# EAGLE design picopower (EAGLE 9.6.1)
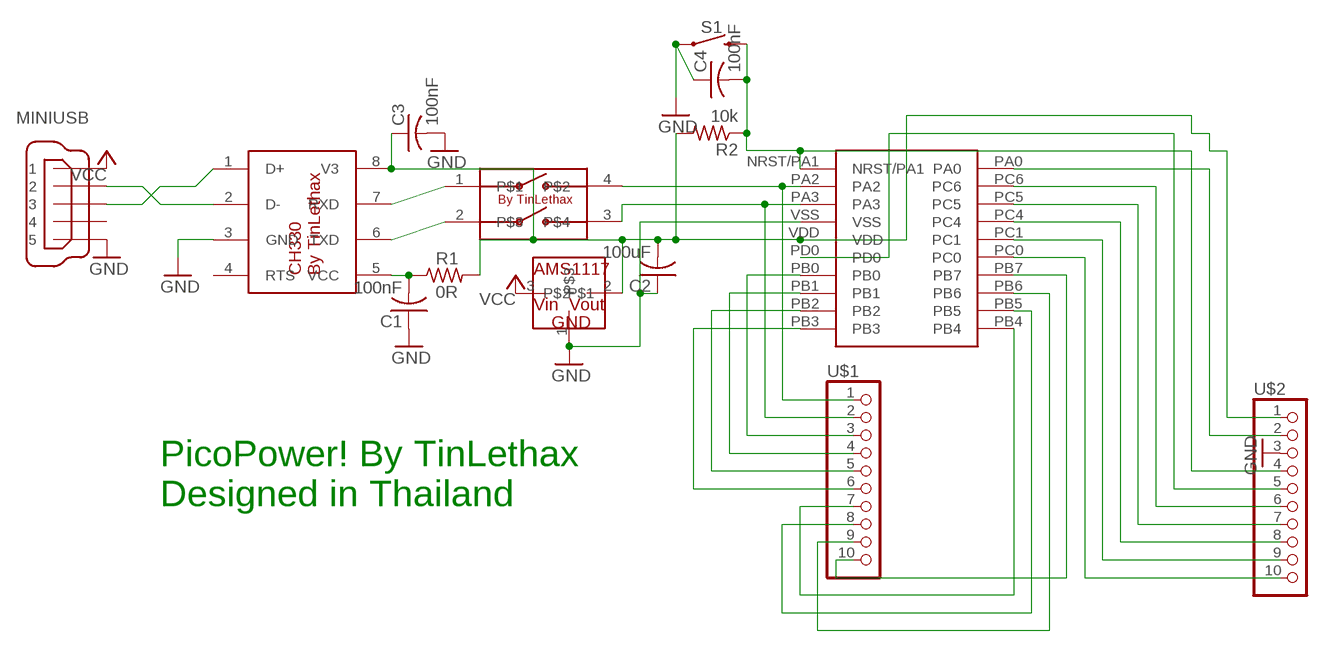
[diagram p0: schematic, sheet 1]

## Parts
2DIP  2DIPSWITCH  [SOIC127P835X230-4N]
C1  100nF  C-USC0603K  [C0603K]
C2  100uF  C-USC0603K  [C0603K]
C3  100nF  C-USC0603K  [C0603K]
C4  100nF  C-USC0603K  [C0603K]
CH330  CH330  [SOIC127P600X150-8N]
MINIUSB  MINI-USB-UX60A-MB-5ST  [UX60A-MB-5ST]
R1  0R  R-US_R0603  [R0603]
R2  10k  R-US_R0603  [R0603]
S1  MOMENTARY-SWITCH-SPST-SMD-6.0X3.5MM  [TACTILE_SWITCH_SMD_6.0X3.5MM]
STM8L  STM8L151F3  [UFQFPN-20]
U$1  PINHD-1X10  [1X10-BIG]
U$2  PINHD-1X10  [1X10-BIG]
U$3  AMS1117  [SOT223]

## Nets
GND: C1.1 C2.1 C3.2 C4.1 CH330.3(GND) MINIUSB.5 S1.1 STM8L.VSS U$2.3 U$3.1
N$1: 2DIP.1 CH330.7(RXD)
N$2: 2DIP.2 CH330.6(TXD)
N$3: 2DIP.4 STM8L.PA2 U$1.1
N$4: 2DIP.3 STM8L.PA3 U$1.2
N$5: C1.2 CH330.5(VCC) R1.1
N$6: C2.2 C3.1 CH330.8(V3) R1.2 R2.2 STM8L.VDD U$2.1 U$3.2
N$8: STM8L.PB0 U$1.3
N$9: STM8L.PB1 U$1.4
N$10: STM8L.PB2 U$1.5
N$11: STM8L.PB3 U$1.6
N$12: STM8L.PB4 U$1.7
N$13: STM8L.PB5 U$1.8
N$14: STM8L.PB6 U$1.9
N$15: STM8L.PB7 U$1.10
N$16: STM8L.PC0 U$2.10
N$17: STM8L.PC1 U$2.9
N$18: STM8L.PC4 U$2.8
N$19: STM8L.PC5 U$2.7
N$20: STM8L.PC6 U$2.6
N$21: CH330.2(D-) MINIUSB.2
N$22: C4.2 R2.1 S1.2 STM8L.NRST/PA1 U$2.4
N$23: STM8L.PA0 U$2.2
N$24: STM8L.PD0 U$2.5
N$25: CH330.1(D+) MINIUSB.3
VCC: MINIUSB.1 U$3.3
Unconnected: CH330.4(RTS) MINIUSB.4

## Notes on the sheet
- PicoPower! By TinLethax
  Designed in Thailand

## Library data of the parts
2DIP = KE_DIP_SWITCH_2:2DIPSWITCH: Shenzhen Ke Rotary Dip Switch (x2); PACKAGE: SOP4
C1-C4 = adafruit:C-US: CAPACITOR, American symbol
CH330 = CH330:CH330: CH330 Super small Serial to USB chip; DESCRIPTION: CH330 Super small Serial to USB chip; PACKAGE: SOP8; PARTNO: CH330
MINIUSB = con-hirose:MINI-USB-: MINI USB Connector Source: http://www.hirose.co.jp/cataloge_hp/e24000019.pdf; OC_FARNELL: unknown; OC_NEWARK: unknown
R1 R2 = adafruit:R-US_: RESISTOR, American symbol
S1 = SparkFun-Switches:MOMENTARY-SWITCH-SPST: Momentary Switch (Pushbutton) - SPST Normally-open (NO) SPST momentary switches (buttons, pushbuttons). Variants PTH-12MM - 12mm square, through-hole Momentary Pushbutton Switch - 12mm Square <https://www.sparkfun.com/products/9190> (COM-09190) PTH-6.0MM, PTH-6.0MM-KIT - 6.0mm square, through-hole Mini Pushbutton Switch <https://www.sparkfun.com/products/97> (COM-00097) KIT package intended for soldering kit's - only one side of pads' copper is exposed. PTH-RIGHT-ANGLE-KIT - Right-angle, through-hole Right Angle Tactile Button <https://www.sparkfun.com/products/10791> - Used on SparkFun BigTime Watch Kit <https://www.sparkfun.com/products/11734> SMD-12MM - 12mm square, surface-mount Tactile Button - SMD (12mm) <https://www.sparkfun.com/products/12993> (COM-12993) Used on SparkFun PicoBoard <https://www.sparkfun.com/products/11888> SMD-4.5MM - 4.5mm Square Trackball Switch Used on SparkFun Blackberry Trackballer Breakout <https://www.sparkfun.com/products/13169> SMD-4.6MMX2.8MM - 4.60mm x 2.80mm, surface mount Used on SparkFun SAMD21 Mini Breakout <https://www.sparkfun.com/products/13664> SMD-5.2MM, SMD-5.2-REDUNDANT - 5.2mm square, surface-mount Mini Pushbutton Switch - SMD <https://www.sparkfun.com/products/8720> (COM-08720) Used on Arduino Pro Mini <https://www.sparkfun.com/products/11114> REDUNDANT package connects both switch circuits together SMD-6.0X3.5MM - 6.0 x 3.5mm, surface mount Momentary Reset Switch SMD <https://www.sparkfun.com/products/8229> (COM-08229) SMD-6.2MM-TALL - 6.2mm square, surface mount Tactile Button - SMD (6mm) <https://www.sparkfun.com/products/12992> Used on SparkFun Digital Sandbox <https://www.sparkfun.com/products/12651> SMD-RIGHT-ANGLE - Right-angle, surface mount Used on SparkFun Block for Intel® Edison - Arduino <https://www.sparkfun.com/products/13036>; PROD_ID: SWCH-00815; SF_SKU: COM-08229
STM8L = STM8L151F3:STM8L151F3: STM8L151F3 8bit mcuwith the 3x3 mm size !
U$1 U$2 = adafruit:PINHD-1X10: Pin header 1x10 0.1" spacing With round pins
U$3 = AMS1117:AMS1117: The The AMS1117 series of adjustable and fixed voltage regulators are designed to provide up to1A output current and to operate down to 1V input-to-output differential. The dropout voltage of the device is guaranteed maximum 1.3V, decreasing at lower load currents.; PARTNO: AMS1117

## Board
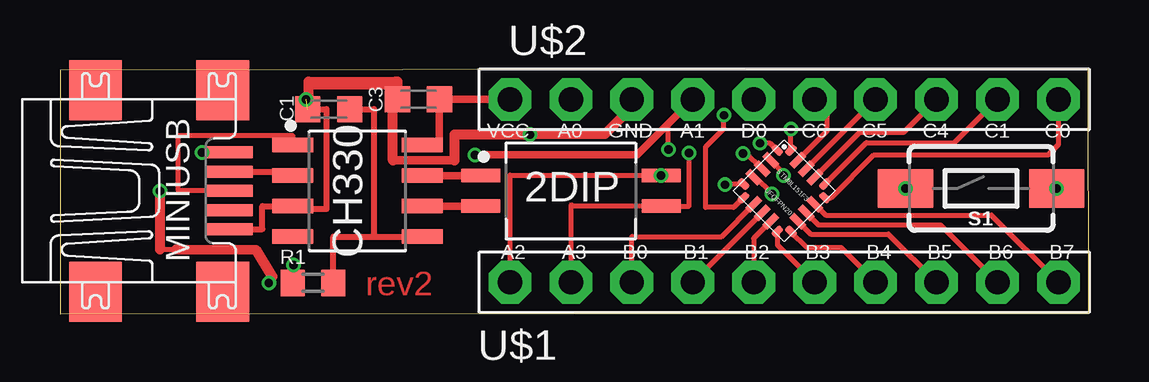
[diagram p1: board, top side]
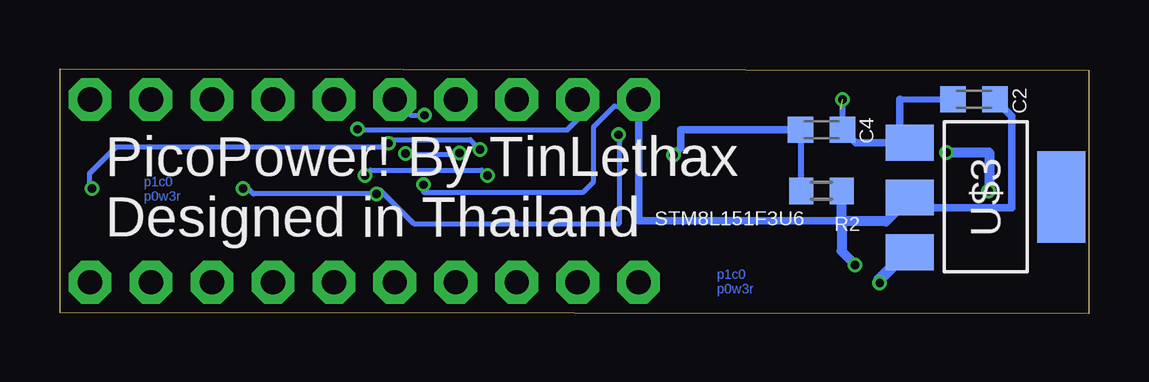
[diagram p2: board, bottom side, seen from below]

Size 42.86 x 10.21 mm. Coordinates in mm from the lower left corner, seen from the top.
Outline: 0,0 42.86,0.05 42.85,10.21 0,10.16 0,0
Copper layers (1*16): Top 0.035559375mm / dielectric 1.6mm / Bottom 0.035559375mm
Design rules "oshpark-2layer": minimum track width 6mil, minimum drill 10mil, track to track 6mil, track to pad 6mil, pad to pad 6mil, via to via 6mil, smd to smd 6mil, copper to edge 15mil, drill to drill 6mil, minimum pad ring 5mil, minimum via ring 5mil, stop-mask expansion 2.5mil, vias tented up to drill 0mil, thermal gap 10mil

### Footprints (pad centres in the part's own frame; a part is rotated, then mirrored left to right if it is on the bottom)
SOIC127P835X230-4N = smd 1.625 x 0.572: 1 -3.763,0.635; 2 -3.763,-0.635; 3 3.763,-0.635; 4 3.763,0.635
C0603K = smd 1.05 x 1.08: 1 -0.875,0; 2 0.875,0
SOIC127P600X150-8N = smd 1.708 x 0.602: 1 -2.7,1.905; 2 -2.7,0.635; 3 -2.7,-0.635; 4 -2.7,-1.905; 5 2.7,-1.905; 6 2.7,-0.635; 7 2.7,0.635; 8 2.7,1.905
UX60A-MB-5ST = smd 2 x 0.5: 1 2.25,1.6; 2 2.25,0.8; 3 2.25,0; 4 2.25,-0.8; 5 2.25,-1.6 | smd 2.2 x 2.5: M1 -3.3,-4.2; M2 -3.3,4.2; M3 2,4.2; M4 2,-4.2
R0603 = smd 1 x 1.1: 1 -0.85,0; 2 0.85,0
TACTILE_SWITCH_SMD_6.0X3.5MM = smd 2.3 x 1.6: 1 -3.15,0; 2 3.15,0
UFQFPN-20 = smd 0.5 x 0.3: NRST/PA1 -1.4,1; PB4 1.4,-1; PC0 1.4,1; VDD -1.4,-1 | smd 0.3 x 0.5: PA0 -1,1.4; PB3 1,-1.4; PC1 1,1.4; PD0 -1,-1.4 | smd 0.7 x 0.3: PA2 -1.3,0.5; PA3 -1.3,0; PB5 1.3,-0.5; PB6 1.3,0; PB7 1.3,0.5; VSS -1.3,-0.5 | smd 0.3 x 0.7: PB0 -0.5,-1.3; PB1 0,-1.3; PB2 0.5,-1.3; PC4 0.5,1.3; PC5 0,1.3; PC6 -0.5,1.3
1X10-BIG = drill 1.016 pad 1.778 octagon: 1 -11.43,0; 2 -8.89,0; 3 -6.35,0; 4 -3.81,0; 5 -1.27,0; 6 1.27,0; 7 3.81,0; 8 6.35,0; 9 8.89,0; 10 11.43,0
SOT223 = smd 1.499 x 2.007: 1 -2.261,-3.15; 2 0.025,-3.15; 3 2.311,-3.15 | smd 3.81 x 2.007: 4 0,3.15

### Placement (x,y rotation side)
2DIP  21.29,5.13 0 top
C1  11.2,8.53 0 top
C2  4.78,8.94 0 bottom
C3  14.94,8.94 180 top
C4  11.13,7.67 180 bottom
CH330  12.4,5.13 0 top
MINIUSB  4.78,5.13 0 top
R1  10.54,1.3 180 top
R2  11.13,5.13 0 bottom
S1  38.38,5.23 0 top
STM8L  30.18,5.13 315 top
U$1  30.18,1.32 0 top
U$2  30.18,8.94 0 top
U$3  4.29,4.88 270 bottom

### Tracks (layer width: path | path; a pad name or v marks a point on that pad's centre or on a via)
GND  (via drill 0.35)  (1 unrouted)
  Top 0.152: C3.2 13.79,9.21 13.79,9.5
  Top 0.203: C1.1 10.35,8.56 | v29.67,5 28.97,5.7 STM8L.VSS
  Top 0.254: MINIUSB.5 8.43,3.53 8.43,4.5 CH330.3 9.7,4.37 11.1,4.37 11.1,8.53 C1.1
  Top 0.305: 13.97,9.68 13.79,9.5 10.33,9.5 C1.1
  Top 0.356: 16.43,6.4 13.87,6.4
  Top 0.406: 10.35,8.56 10.35,9.68 13.97,9.68 14.06,9.68 C3.2 13.87,8.75 13.87,6.4 | U$2.3 23.83,8.61 22.71,7.49 19.61,7.49 v19.58,7.47 16.43,7.47 16.43,6.4
  Bottom 0.203: 23.83,3.84 23.9,3.76 | 23.9,3.76 28.12,3.76 29.52,5.16 v29.67,5 34.8,5 35.03,5.23 S1.1 | 23.9,3.76 19.56,3.76 19.56,7.44 v19.58,7.47
  Bottom 0.254: 7.87,8.94 C2.1 | C4.1 10.24,8.99 10.25,8.99 v10.25,8.94
  Bottom 0.305: 7.87,8.94 7.87,7.57 U$3.1 9.7,7.14 C4.1
  other vias: 35.23,5.23
N$1
  Top 0.305: CH330.7 2DIP.1
N$2
  Top 0.305: CH330.6 2DIP.2
N$3  (via drill 0.35)
  Top 0.203: v25.05,5.77 18.77,5.77 18.75,5.79 U$1.1 | STM8L.PA2 30.15,5.87 30.2,5.87 30.2,5.82 v30.15,5.77
  Bottom 0.203: v30.15,5.77 29.92,5.99 25.28,5.99 v25.05,5.77
N$4  (via drill 0.35)
  Top 0.203: U$1.2 21.29,4.52 21.31,4.55 21.36,4.5 2DIP.3 26.21,4.5 v26.21,6.71 | v28.46,6.69 28.51,6.74 28.56,6.74 STM8L.PA3
  Bottom 0.203: v28.46,6.69 28.46,6.65 26.26,6.65 v26.21,6.71
N$5
  Top 0.254: R1.1 11.39,3.23 CH330.5 13.08,3.23 13.08,8.53 C1.2
N$6  (via drill 0.35)
  Top 0.203: CH330.8 15.81,7.04 | STM8L.VDD 27.74,5.41 v27.71,5.38
  Top 0.305: 15.81,7.04 C3.1 U$2.1
  Top 0.406: v9.73,2.03 9.73,1.33 R1.2
  Bottom 0.203: v27.71,5.38 27.71,5.08 21.06,5.08 20.63,5.51 20.63,7.8 19.76,8.66 18.85,8.66 18.75,8.76
  Bottom 0.305: R2.2 10.29,5.13 10.29,3.89 18.75,3.89 18.75,8.76 U$2.1 | C2.2 3.19,8.23 3.19,4.42 7.01,4.42 U$3.2
  Bottom 0.406: U$3.2 8.43,3.86 10.28,3.86 R2.2 | 10.29,3.89 10.29,2.62 9.73,2.06 v9.73,2.03
N$8
  Top 0.203: U$1.3 23.83,3.23 27.56,3.23 STM8L.PB0
N$9
  Top 0.203: U$1.4 STM8L.PB1
N$10
  Top 0.203: STM8L.PB2 28.91,3.15 U$1.5
N$11
  Top 0.203: STM8L.PB3 29.89,2.87 U$1.6
N$12
  Top 0.203: STM8L.PB4 31.12,2.77 32.54,2.77 U$1.7
N$13
  Top 0.203: STM8L.PB5 31.27,3.33 34.52,3.33 U$1.8
N$14
  Top 0.203: STM8L.PB6 31.6,3.71 36.68,3.71 U$1.9
N$15
  Top 0.203: STM8L.PB7 31.9,4.11 38.81,4.11 U$1.10
N$16
  Top 0.203: STM8L.PC0 32.13,4.85 33.91,6.63 41.17,6.63 41.61,7.06 U$2.10
N$17
  Top 0.203: STM8L.PC1 33.6,7.14 37.26,7.14 U$2.9
N$18
  Top 0.203: STM8L.PC4 33.32,7.57 35.15,7.57 U$2.8
N$19
  Top 0.203: STM8L.PC5 U$2.7
N$20
  Top 0.203: STM8L.PC6 31.98,7.64 31.98,8.41 U$2.6
N$21
  Top 0.254: MINIUSB.2 9.7,5.93 CH330.2
N$22  (via drill 0.35)
  Top 0.203: U$2.4 25.32,7.9 25.32,6.88 v25.35,6.86 | 29.63,7.09 STM8L.NRST/PA1 29.9,6.82 29.9,6.8 29.59,7.11 v29.16,7.11
  Top 0.305: v17.3,6.63 24.05,6.63 U$2.4
  Bottom 0.203: S1.2 41.61,5.16 41.63,5.16 41.63,5.84 40.51,6.96 29.03,6.96 29.17,7.1 v29.16,7.11 29.01,7.26 25.76,7.26 v25.35,6.86
  Bottom 0.254: C4.2 12,5.13 R2.1
  Bottom 0.305: C4.2 16.99,7.67 16.99,6.93 v17.3,6.63
  other vias: 41.53,5.23
N$23  (via drill 0.35)
  Top 0.203: STM8L.PA0 v30.46,7.69 v30.45,7.7
  Bottom 0.203: v30.45,7.7 30.45,7.67 21.72,7.67 21.29,8.1 U$2.2
N$24  (via drill 0.35)
  Top 0.203: STM8L.PD0 28.07,4.44 26.9,4.44 26.9,6.96 27.66,7.72 v27.66,8.28
  Bottom 0.203: U$2.5 28.25,8.28 v27.66,8.28
N$25
  Top 0.203: MINIUSB.3 4.93,5.13 4.93,7.44 9.7,7.44 CH330.1
VCC  (via drill 0.35)
  Top 0.203: 4.17,2.69 4.83,2.69
  Top 0.254: v5.92,6.73 5.97,6.68 6.97,6.68 MINIUSB.1
  Top 0.406: v4.17,5.13 4.17,2.69 | 4.83,2.69 8.17,2.67 8.85,1.56 v8.7,1.28
  Top 0.508: v8.7,1.28 8.71,1.3
  Bottom 0.305: U$3.3 7.57,2.57 8.15,2.57
  Bottom 0.406: v5.92,6.73 4.14,6.73 4.14,5.16 v4.17,5.13
  Bottom 0.508: v8.7,1.28 8.7,1.43 7.57,2.57

### Text on the board
Top: rev2
Bottom: p1c0 / p0w3r | p1c0 / p0w3r
tNames: VCC | A0 | GND | A1 | D0 | C6 | C5 | C4 | C1 | C0 | A2 | A3 | B0 | B1 | B2 | B3 | B4 | B5 | B6 | B7
bNames: STM8L151F3U6 | PicoPower! By TinLethax / Designed in Thailand